# Altium schematic sheet PD_BCR_Connections.SchDoc: PD BCR Connections
size 292 x 193 mm; SheetNumber: 5; SheetTotal: 11; SheetSize: A4
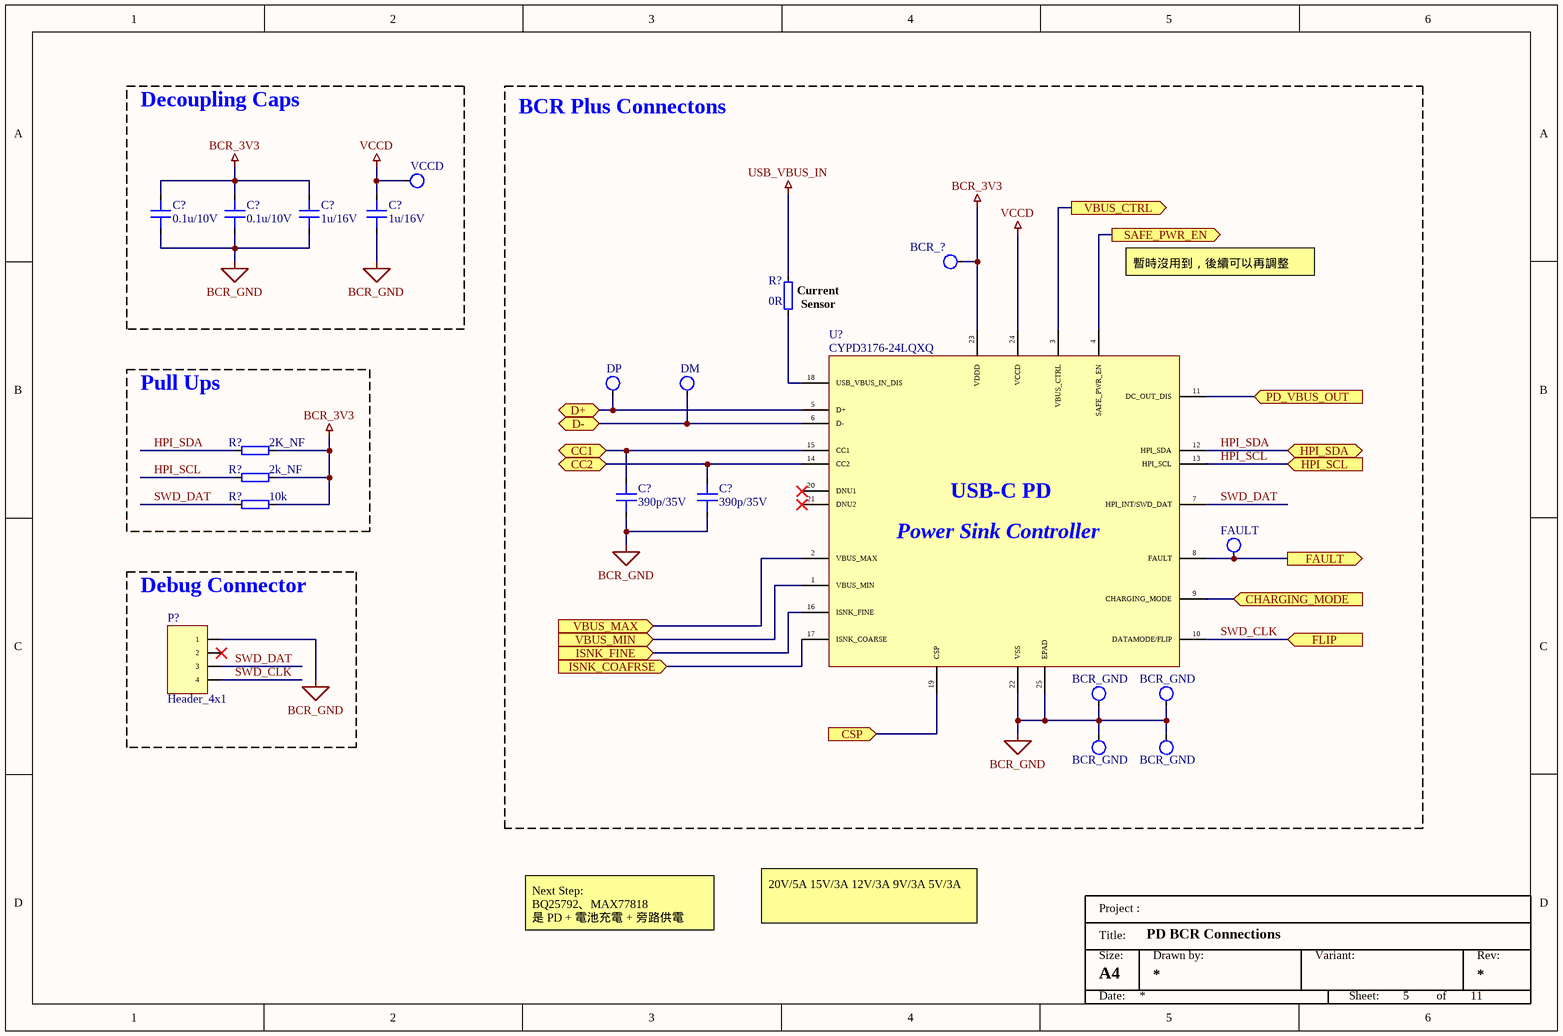
[diagram p0: PD_BCR_Connections.SchDoc]

## Parts
(Parts that share a designator on the sheet are numbered #1, #2 ... from top to bottom, then left to right.)
BCR_?  DIP_small_Red  [TestPoint_dip_big]  (value not drawn)
BCR_GND#1  DIP_small_Black  [TestPoint_dip_small]  (value not drawn)
BCR_GND#2  DIP_small_Black  [TestPoint_dip_small]  (value not drawn)
BCR_GND#3  DIP_small_Black  [TestPoint_dip_small]  (value not drawn)
BCR_GND#4  DIP_small_Black  [TestPoint_dip_small]  (value not drawn)
C?#1  0.1u/10V  [0805_Cap]
C?#2  0.1u/10V  [0805_Cap]
C?#3  1u/16V  [0805_Cap]
C?#4  1u/16V  [0805_Cap]
C?#5  390p/35V  [0805_Cap]
C?#6  390p/35V  [0805_Cap]
DM  SMD_25mil  [TestPoint_dip_big]  (value not drawn)
DP  SMD_25mil  [TestPoint_dip_big]  (value not drawn)
FAULT  SMD_25mil  [TestPoint_dip_big]  (value not drawn)
P?  Header_4x1  [XT60PW-M]
R?#1  0R  [0603_Res]
R?#2  2K_NF  [0603_Res]
R?#3  2k_NF  [0603_Res]
R?#4  10k  [0603_Res]
U?  CYPD3176-24LQXQ  [QFN-24]
VCCD  SMD_25mil  [TestPoint_dip_big]  (value not drawn)

## Blocks framed on the sheet
Decoupling Caps: C?#1-C?#4 VCCD
BCR Plus Connectons: BCR_? BCR_GND#1-BCR_GND#4 C?#5 C?#6 DM DP FAULT R?#1 U?
Pull Ups: R?#2-R?#4
Debug Connector: P?

## Ports
CC1 (bidir), CC2 (bidir), CHARGING_MODE (in), CSP (in), D+ (bidir), D- (bidir), FAULT (out), FLIP (in), HPI_SCL (in), HPI_SDA (bidir), ISNK_COAFRSE (in), ISNK_FINE (in), PD_VBUS_OUT (in), SAFE_PWR_EN (out), VBUS_CTRL (out), VBUS_MAX (in), VBUS_MIN (in)

## Nets
BCR_3V3: BCR_?.1 C?#1.1 C?#2.1 C?#3.1 R?#2.2 R?#3.2 R?#4.2 U?.23(VDDD)
BCR_GND: BCR_GND#1.1 BCR_GND#2.1 BCR_GND#3.1 BCR_GND#4.1 C?#1.2 C?#2.2 C?#3.2 C?#4.2 C?#5.2 C?#6.2 P?.1 U?.22(VSS) U?.25(EPAD)
USB_VBUS_IN: R?#1.1
VCCD: C?#4.1 U?.24(VCCD) VCCD.1
CC1: C?#5.1 U?.15(CC1) ; port CC1
CC2: C?#6.1 U?.14(CC2) ; port CC2
CHARGING_MODE: U?.9(CHARGING_MODE) ; port CHARGING_MODE
CSP: U?.19(CSP) ; port CSP
D+: DP.1 U?.5(D+) ; port D+
D-: DM.1 U?.6(D-) ; port D-
FAULT: FAULT.1 U?.8(FAULT) ; port FAULT
HPI_SCL: R?#3.1 U?.13(HPI_SCL) ; port HPI_SCL
HPI_SDA: R?#2.1 U?.12(HPI_SDA) ; port HPI_SDA
ISNK_COAFRSE: U?.17(ISNK_COARSE) ; port ISNK_COAFRSE
ISNK_FINE: U?.16(ISNK_FINE) ; port ISNK_FINE
PD_VBUS_OUT: U?.11(DC_OUT_DIS) ; port PD_VBUS_OUT
SAFE_PWR_EN: U?.4(SAFE_PWR_EN) ; port SAFE_PWR_EN
SWD_CLK: P?.4 U?.10(DATAMODE/FLIP) ; port FLIP
SWD_DAT: P?.3 R?#4.1 U?.7(HPI_INT/SWD_DAT)
VBUS_CTRL: U?.3(VBUS_CTRL) ; port VBUS_CTRL
VBUS_MAX: U?.2(VBUS_MAX) ; port VBUS_MAX
VBUS_MIN: U?.1(VBUS_MIN) ; port VBUS_MIN
NetR?#1_2: R?#1.2 U?.18(USB_VBUS_IN_DIS)

Not connected (* = marked no-connect by the designer): P? 2*; U? 20(DNU1)* 21(DNU2)*

## Notes on the sheet
- (near R?#1) Current
  Sensor
- 暫時沒用到，後續可以再調整
- Next Step:
  BQ25792、MAX77818
  是 PD + 電池充電 + 旁路供電
- 20V/5A 15V/3A 12V/3A 9V/3A 5V/3A
- Project :
- Size:
- Title:
- Drawn by:
- Variant:
- Rev:
- Date:
- Sheet:
- of
- (in symbol CYPD3176-24LQXQ) USB-C PD; Power Sink Controller

## Library data of the parts
BCR_? BCR_GND#1-BCR_GND#4 DM DP FAULT VCCD = Test_Point: General test point; Mfr. #: N/A; Mfr.: N/A; Distributor_Link: N/A; Datasheet: N/A; Distributor #: N/A
C?#1-C?#6 = Cap: General capacitor (non-polarized); Mfr. #: *; Mfr.: *; Distributor_Link: *; Datasheet: *; Distributor #: *
P? = Header_4x1: General header 4x1; Mfr. #: *; Mfr.: *; Distributor_Link: *; Datasheet: *; Distributor #: *
R?#1 = Res: Thick Film Resistors - SMD 0Ohm 0805 31.6A Jumper Hi Curr; Mfr. #: *; Mfr.: *; Distributor_Link: *; Datasheet: *; Distributor #: *
R?#2-R?#4 = Res: General Resistor; Mfr. #: *; Mfr.: *; Distributor_Link: *; Datasheet: *; Distributor #: *
U? = CYPD3176-24LQXQ: USB Interface IC USB Type-C port controller (BCR-PLUS) CYPD3176; Mfr. #: CYPD3176-24LQXQT; Mfr.: Infineon Technologies; Distributor_Link: https://www.mouser.tw/ProductDetail/Infineon-Technologies/CYPD3176-24LQXQT?qs=A6eO%252BMLsxmQEa4cjIEO1Eg%3D%3D; Datasheet: https://www.mouser.tw/datasheet/2/196/Infineon_CYPD3176_24LQXQ_DataSheet_v01_00_EN-3161635.pdf; Distributor #: 727-CYPD3176-24LQXQT